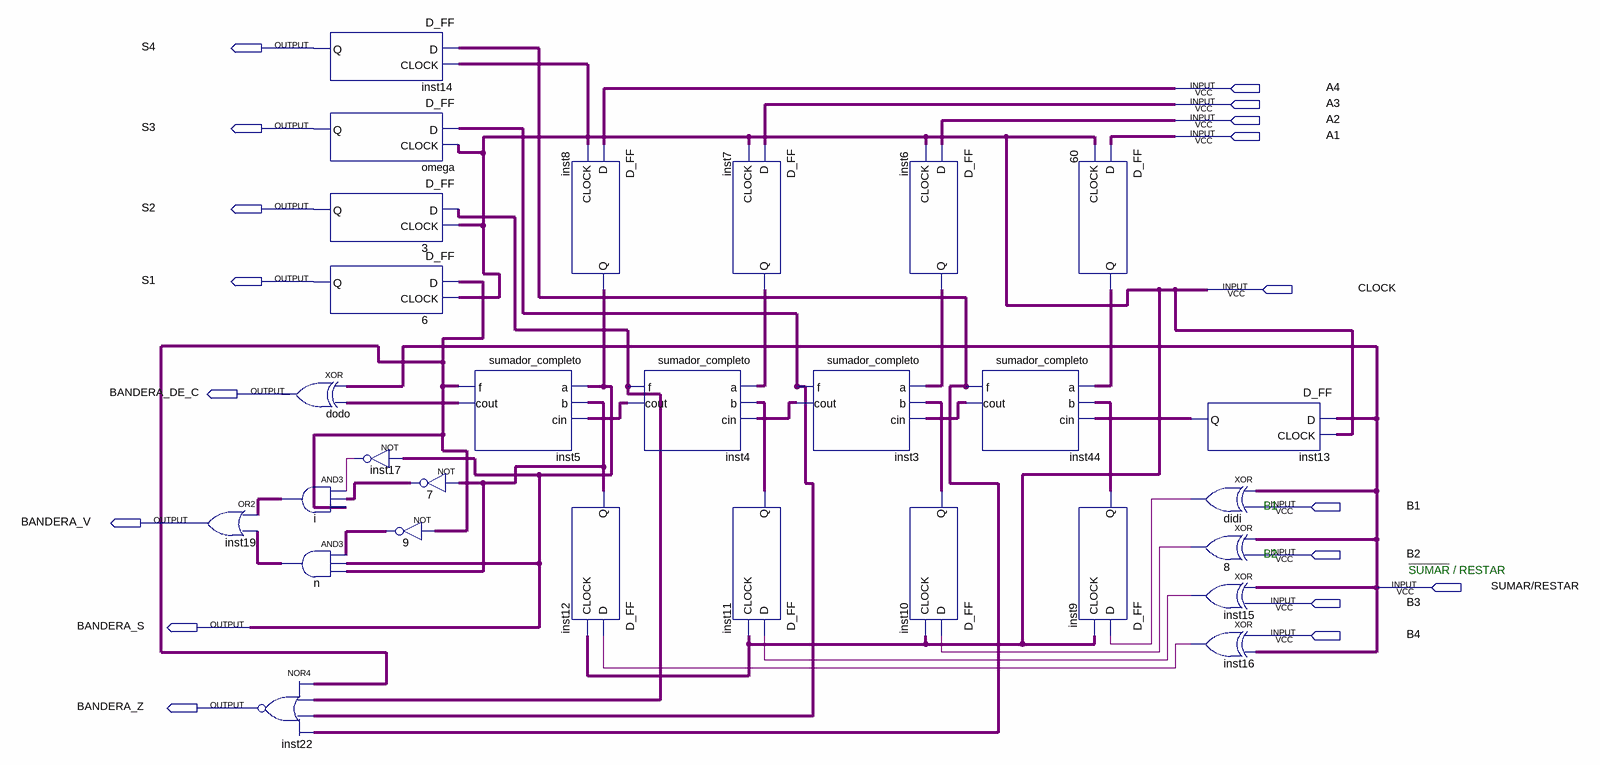
[diagram p0: schematic sheet]
// Quartus schematic sumador_restador_completo.bdf as structural Verilog: 29 symbols, 18 pins
module sumador_restador_completo (
  input  A4,
  input  A3,
  input  A2,
  input  A1,
  input  CLOCK,
  input  B1,
  input  B2,
  input  \SUMAR/RESTAR ,
  input  B3,
  input  B4,
  output S4,
  output S3,
  output S2,
  output S1,
  output BANDERA_DE_C,
  output BANDERA_V,
  output BANDERA_S,
  output BANDERA_Z
);

  wire didi_out, i_out, inst3_cout, inst3_f, inst4_cout, inst4_f, inst5_cout, inst5_f, inst6_q, inst7_q,
       inst9_q, inst10_q, inst11_q, inst12_q, inst13_q, inst15_out, inst16_out, inst17_out, inst44_cout,
       inst44_f, n7_out, n8_out, n9_out, n60_q, n_out;

  or inst19 (BANDERA_V, i_out, n_out);
  xor dodo (BANDERA_DE_C, \SUMAR/RESTAR , inst5_cout);
  and i (i_out, inst17_out, n7_out, inst5_f);
  and n (n_out, n9_out, BANDERA_S, inst12_q);
  nor inst22 (BANDERA_Z, inst5_f, inst4_f, inst3_f, inst44_f);
  D_FF inst14 (.D(inst44_f), .CLOCK(CLOCK), .Q(S4));
  D_FF omega (.D(inst3_f), .CLOCK(CLOCK), .Q(S3));
  D_FF u_3 (.D(inst4_f), .CLOCK(CLOCK), .Q(S2));
  D_FF u_6 (.D(inst5_f), .CLOCK(CLOCK), .Q(S1));
  not inst17 (inst17_out, BANDERA_S);
  not u_7 (n7_out, inst12_q);
  not u_9 (n9_out, inst5_f);
  sumador_completo inst5 (.a(BANDERA_S), .b(inst12_q), .cin(inst4_cout), .f(inst5_f), .cout(inst5_cout));
  D_FF inst8 (.D(A4), .CLOCK(CLOCK), .Q(BANDERA_S));
  D_FF inst12 (.D(inst16_out), .CLOCK(CLOCK), .Q(inst12_q));
  sumador_completo inst4 (.a(inst7_q), .b(inst11_q), .cin(inst3_cout), .f(inst4_f), .cout(inst4_cout));
  D_FF inst7 (.D(A3), .CLOCK(CLOCK), .Q(inst7_q));
  D_FF inst11 (.D(inst15_out), .CLOCK(CLOCK), .Q(inst11_q));
  sumador_completo inst3 (.a(inst6_q), .b(inst10_q), .cin(inst44_cout), .f(inst3_f), .cout(inst3_cout));
  D_FF inst6 (.D(A2), .CLOCK(CLOCK), .Q(inst6_q));
  D_FF inst10 (.D(n8_out), .CLOCK(CLOCK), .Q(inst10_q));
  sumador_completo inst44 (.a(n60_q), .b(inst9_q), .cin(inst13_q), .f(inst44_f), .cout(inst44_cout));
  D_FF u_60 (.D(A1), .CLOCK(CLOCK), .Q(n60_q));
  D_FF inst9 (.D(didi_out), .CLOCK(CLOCK), .Q(inst9_q));
  D_FF inst13 (.D(\SUMAR/RESTAR ), .CLOCK(CLOCK), .Q(inst13_q));
  xor didi (didi_out, \SUMAR/RESTAR , B1);
  xor u_8 (n8_out, \SUMAR/RESTAR , B2);
  xor inst15 (inst15_out, \SUMAR/RESTAR , B3);
  xor inst16 (inst16_out, B4, \SUMAR/RESTAR );

  // Notes on the sheet:
  //   B1
  //   B2
  //   SUMAR / RESTAR
endmodule
